# EasyEDA schematic SCH_BME 280 Sensor.json
TITLE: BME280 Sensor; REV: 1.0; Date: 2022-09-01; Sheet: 1/1; Drawn By: -md; Company: RarachTime
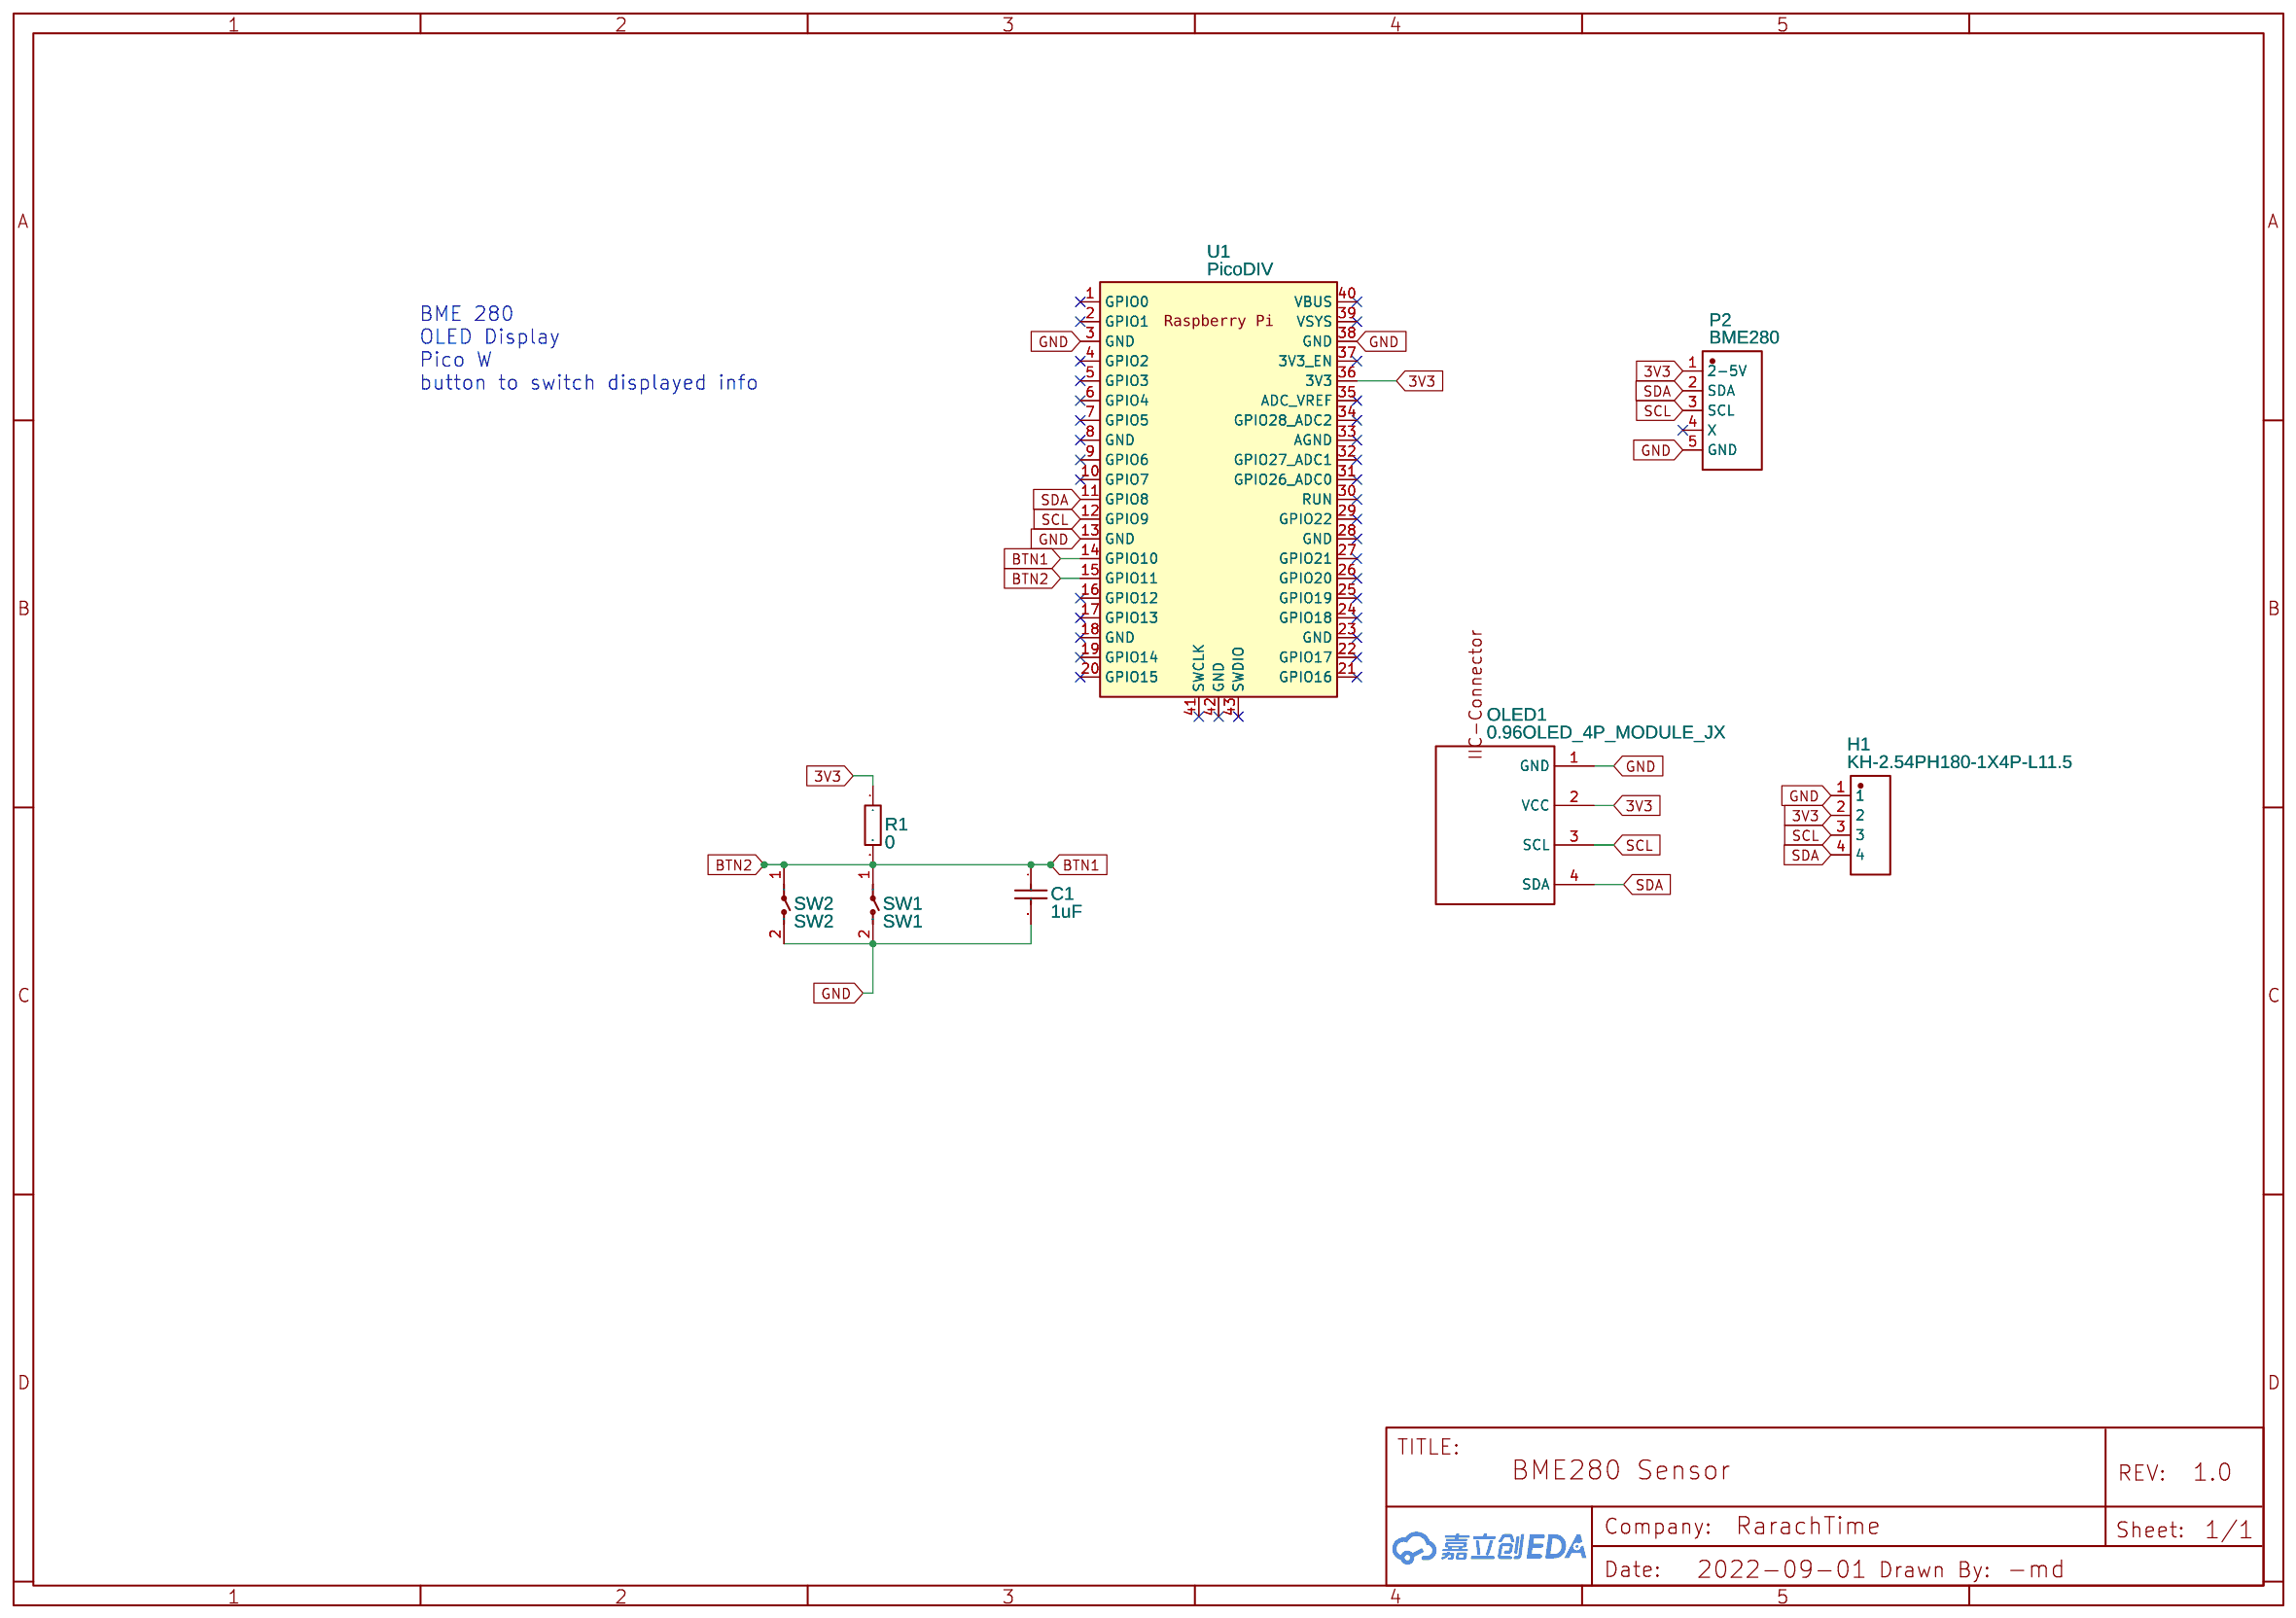
[diagram p0: schematic sheet]

## Parts
C1  1uF  [C0805]
H1  KH-2.54PH180-1X4P-L11.5  [HDR-TH_4P-P2.54-V-M]
OLED1  0.96OLED_4P_MODULE_JX  [0.96OLED_4P]
P2  BME280  [BME680_PIMORONI]
R1  0  [R0805]
SW1  SW1  [SW-SMD_L6.0-W3.5-LS8.0-EH]
SW2  SW2  [SW-SMD_L6.0-W3.5-LS8.0-EH]
U1  PicoDIV  [RPI_PICO_SMD_TH]

## Library data of the parts
C1 = CL21B105KBFNNNE: Supplier: LCSC; Manufacturer: SAMSUNG; Supplier Part: C28323; JLCPCB Part Class: Basic Part
H1 = KH-2.54PH180-1X4P-L11.5: Supplier: LCSC; Supplier Part: C2905435; Manufacturer: kinghelm(金航标); Contributor: LCSC; JLCPCB Part Class: Extended Part
OLED1 = 0.96OLED_4P_MODULE_JX: Supplier: LCSC; Supplier Part: C9900004566; Manufacturer: null; Contributor: LCSC; JLCPCB Part Class: Extended Part
P2 = BME680_PIMORONI: Supplier Part: C50951; Manufacturer: ReliaPro; Manufacturer Part: 2.54mm 1*5P Header; Contributor: timoschrevel
R1 = 0805W8F0000T5E: Supplier: LCSC; Manufacturer: UniOhm; Supplier Part: C17477; JLCPCB Part Class: Basic Part
SW1 SW2 = TS-1001T-AC04316: Supplier: LCSC; Supplier Part: C720484; Manufacturer: XUNPU; Contributor: LCSC; JLCPCB Part Class: Extended Part
U1 = Pico: Contributor: Alexey Gumenchuk

## Nets
3V3: H1.2 OLED1.2(VCC) P2.1(2-5V) R1.1 U1.36(3V3)
GND: C1.2 H1.1 OLED1.1(GND) P2.5(GND) SW1.2 SW2.2 U1.3(GND) U1.13(GND) U1.38(GND)
BTN1: C1.1 R1.2 SW1.1 SW2.1 U1.14(GPIO10) U1.15(GPIO11)
SCL: H1.3 OLED1.3(SCL) P2.3(SCL) U1.12(GPIO9)
SDA: H1.4 OLED1.4(SDA) P2.2(SDA) U1.11(GPIO8)

Not connected (* = marked no-connect by the designer): P2 4(X)*; U1 1(GPIO0)* 2(GPIO1)* 4(GPIO2)* 5(GPIO3)* 6(GPIO4)* 7(GPIO5)* 8(GND)* 9(GPIO6)* 10(GPIO7)* 16(GPIO12)* 17(GPIO13)* 18(GND)* 19(GPIO14)* 20(GPIO15)* 21(GPIO16)* 22(GPIO17)* 23(GND)* 24(GPIO18)* 25(GPIO19)* 26(GPIO20)* 27(GPIO21)* 28(GND)* 29(GPIO22)* 30(RUN)* 31(GPIO26_ADC0)* 32(GPIO27_ADC1)* 33(AGND)* 34(GPIO28_ADC2)* 35(ADC_VREF)* 37(3V3_EN)* 39(VSYS)* 40(VBUS)* 41(SWCLK)* 42(GND)* 43(SWDIO)*

## Notes on the sheet
- BME 280
  OLED Display
  Pico W
  button to switch displayed info
